# EAGLE design 2voices main (EAGLE 7.4.0)

## Sheet 1 of 2
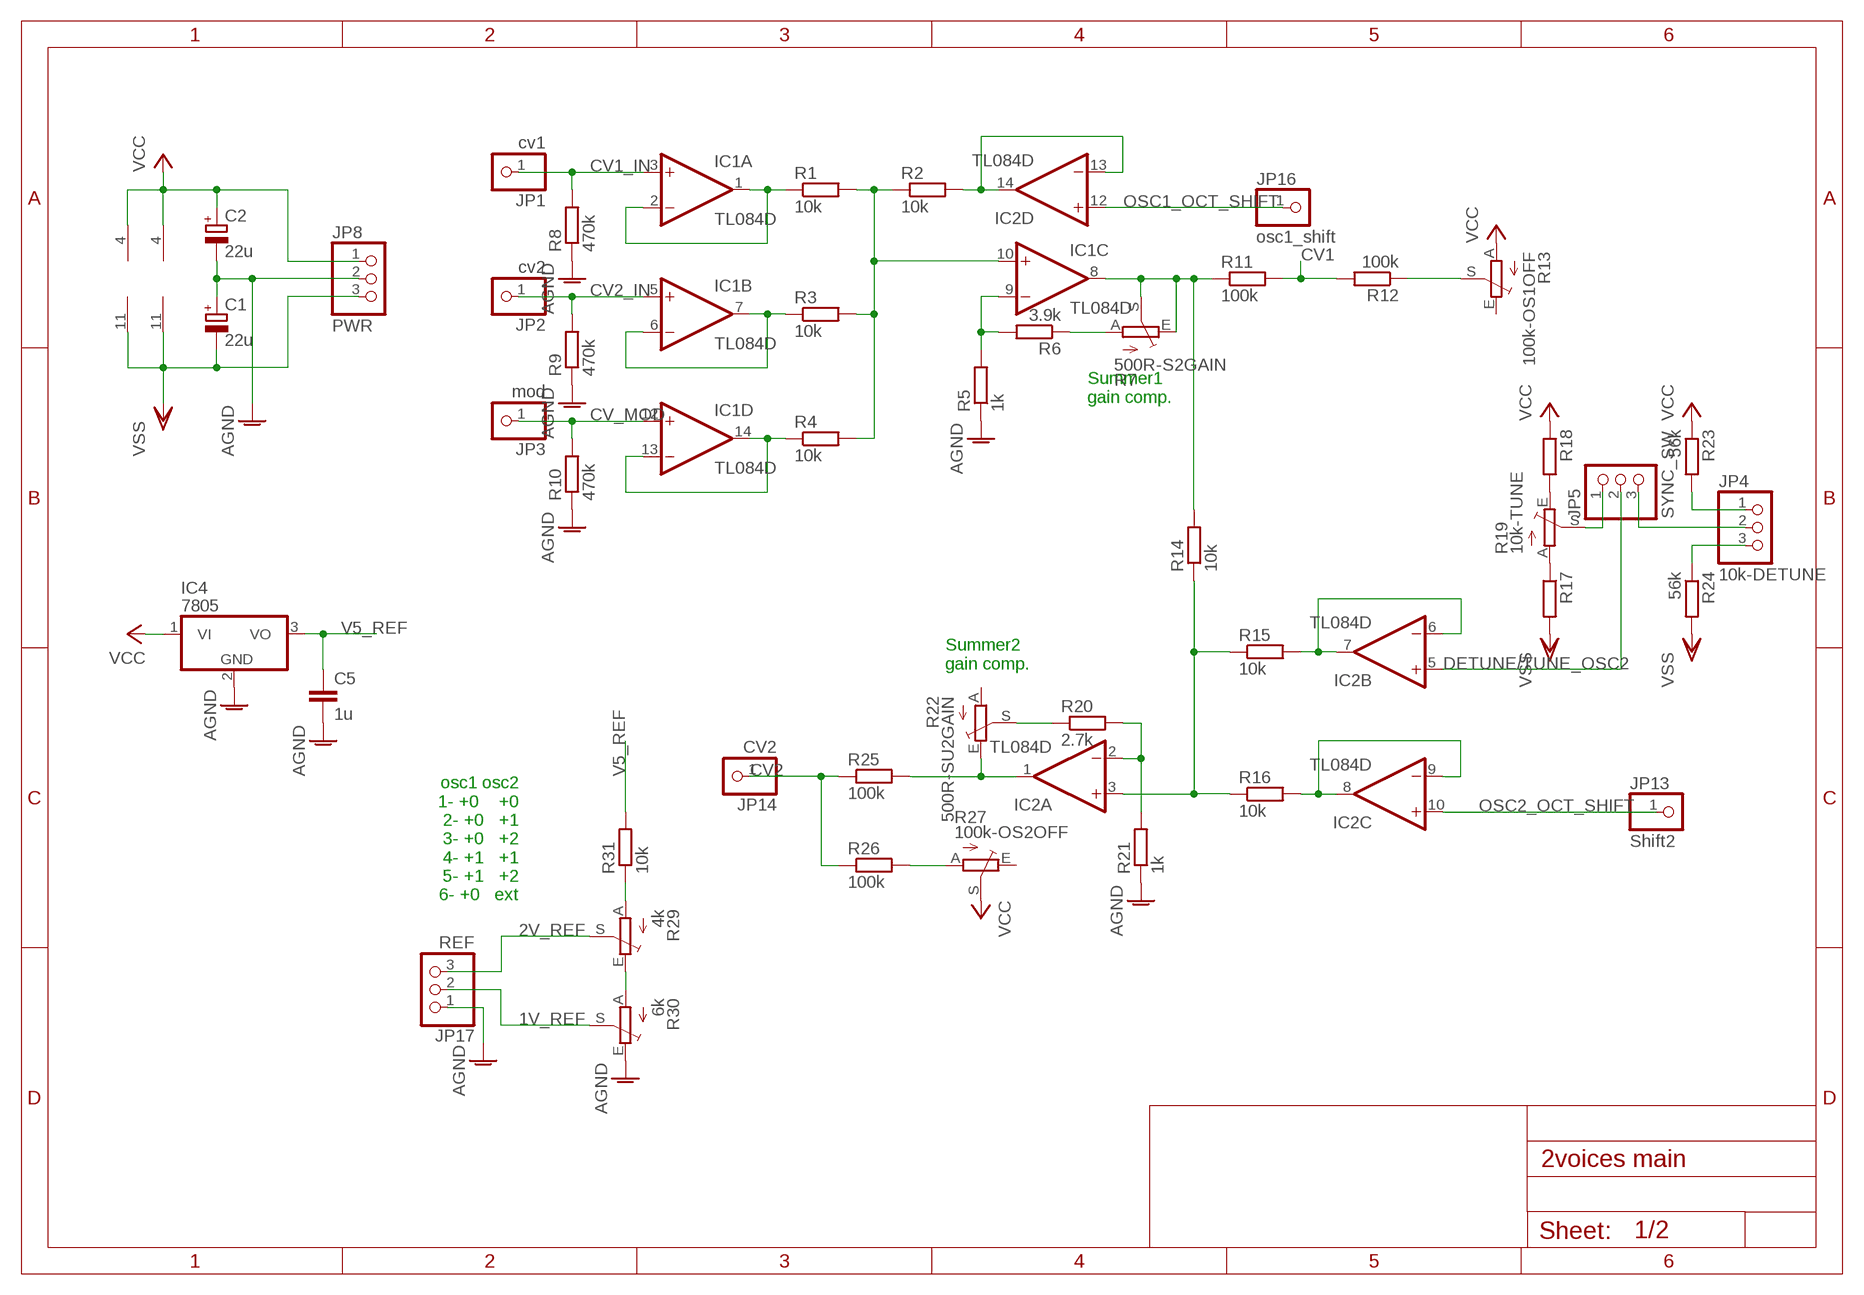
[diagram p0: schematic, sheet 1]

### Parts
C1  22u  CPOL-EUE2.5-7  [E2,5-7]
C2  22u  CPOL-EUE2.5-7  [E2,5-7]
C5  1u  C-EUC0805  [C0805]
IC1  TL084D  [SO14]
IC2  TL084D  [SO14]
IC4  7805  7805TV  [TO220V]
JP1  cv1  PINHD-1X1  [1X01]
JP2  cv2  PINHD-1X1  [1X01]
JP3  mod  PINHD-1X1  [1X01]
JP4  10k-DETUNE  PINHD-1X3  [1X03]
JP5  SYNC_SW  PINHD-1X3  [1X03]
JP8  PWR  PINHD-1X3  [1X03]
JP13  Shift2  PINHD-1X1  [1X01]
JP14  CV2  PINHD-1X1  [1X01]
JP16  osc1_shift  PINHD-1X1  [1X01]
JP17  REF  PINHD-1X3  [1X03]
R1  10k  R-EU_R0805  [R0805]
R2  10k  R-EU_R0805  [R0805]
R3  10k  R-EU_R0805  [R0805]
R4  10k  R-EU_R0805  [R0805]
R5  1k  R-EU_R0805  [R0805]
R6  3.9k  R-EU_R0805  [R0805]
R7  500R-S2GAIN  TRIM_EU-S63S  [S63S]
R8  470k  R-EU_R0805  [R0805]
R9  470k  R-EU_R0805  [R0805]
R10  470k  R-EU_R0805  [R0805]
R11  100k  R-EU_R0805  [R0805]
R12  100k  R-EU_R0805  [R0805]
R13  100k-OS1OFF  TRIM_EU-S63S  [S63S]
R14  10k  R-EU_R0805  [R0805]
R15  10k  R-EU_R0805  [R0805]
R16  10k  R-EU_R0805  [R0805]
R17  R-EU_R0805  [R0805]
R18  R-EU_R0805  [R0805]
R19  10k-TUNE  TRIM_EU-S63S  [S63S]
R20  2.7k  R-EU_R0805  [R0805]
R21  1k  R-EU_R0805  [R0805]
R22  500R-SU2GAIN  TRIM_EU-S63S  [S63S]
R23  56k  R-EU_R0805  [R0805]
R24  56k  R-EU_R0805  [R0805]
R25  100k  R-EU_R0805  [R0805]
R26  100k  R-EU_R0805  [R0805]
R27  100k-OS2OFF  TRIM_EU-S63S  [S63S]
R29  4k  TRIM_EU-S63S  [S63S]
R30  6k  TRIM_EU-S63S  [S63S]
R31  10k  R-EU_R0805  [R0805]

### Nets
1V_REF: JP17.2 R30.S
2V_REF: JP17.3 R29.S
AGND: C1.+ C2.- C5.2 IC4.2(GND) JP8.2 JP17.1 R5.1 R8.1 R9.1 R10.1 R21.1 R30.E ; also sheet 2
CV1: R11.2 R12.2
CV1_IN: IC1.3(A:+IN) JP1.1 R8.2
CV2: JP14.1 R25.1 R26.1
CV2_IN: IC1.5(B:+IN) JP2.1 R9.2
CV_MOD: IC1.12(D:+IN) JP3.1 R10.2
DETUNE/TUNE_OSC2: IC2.5(B:+IN) JP5.2
N$2: IC2.13(D:-IN) IC2.14(D:OUT) R2.2
N$3: R29.E R30.A
N$4: IC1.1(A:OUT) IC1.2(A:-IN) R1.1
N$5: R17.1 R19.A
N$6: IC1.6(B:-IN) IC1.7(B:OUT) R3.1
N$7: IC1.13(D:-IN) IC1.14(D:OUT) R4.1
N$8: IC1.10(C:+IN) R1.2 R2.1 R3.2 R4.2
N$9: IC1.9(C:-IN) R5.2 R6.2
N$10: R6.1 R7.A
N$11: R29.A R31.1
N$12: R12.1 R13.S
N$13: IC1.8(C:OUT) R7.E R7.S R11.1 R14.2
N$14: R18.2 R19.E
N$15: IC2.1(A:OUT) R22.E R25.2
N$16: R20.1 R22.S
N$17: IC2.2(A:-IN) R20.2 R21.2
N$18: IC2.3(A:+IN) R14.1 R15.1 R16.1
N$19: IC2.6(B:-IN) IC2.7(B:OUT) R15.2
N$20: JP4.1 R23.2
N$21: JP4.3 R24.1
N$22: JP4.2 JP5.3
N$23: JP5.1 R19.S
N$25: IC2.8(C:OUT) IC2.9(C:-IN) R16.2
N$28: R26.2 R27.A
OSC1_OCT_SHIFT: IC2.12(D:+IN) JP16.1
OSC2_OCT_SHIFT: IC2.10(C:+IN) JP13.1
V5_REF: C5.1 IC4.3(VO) R31.2
VCC: C2.+ IC1.4(P:V+) IC2.4(P:V+) IC4.1(VI) JP8.1 R13.A R18.1 R23.1 R27.S ; also sheet 2
VSS: C1.- IC1.11(P:V-) IC2.11(P:V-) JP8.3 R17.2 R24.2 ; also sheet 2
Unconnected: R13.E R22.A R27.E

### Notes on the sheet
- Summer1
  gain comp.
- Summer2
  gain comp.
- osc1 osc2
  1- +0    +0
  2- +0   +1
  3- +0   +2
  4- +1   +1
  5- +1   +2
  6- +0   ext

## Sheet 2 of 2
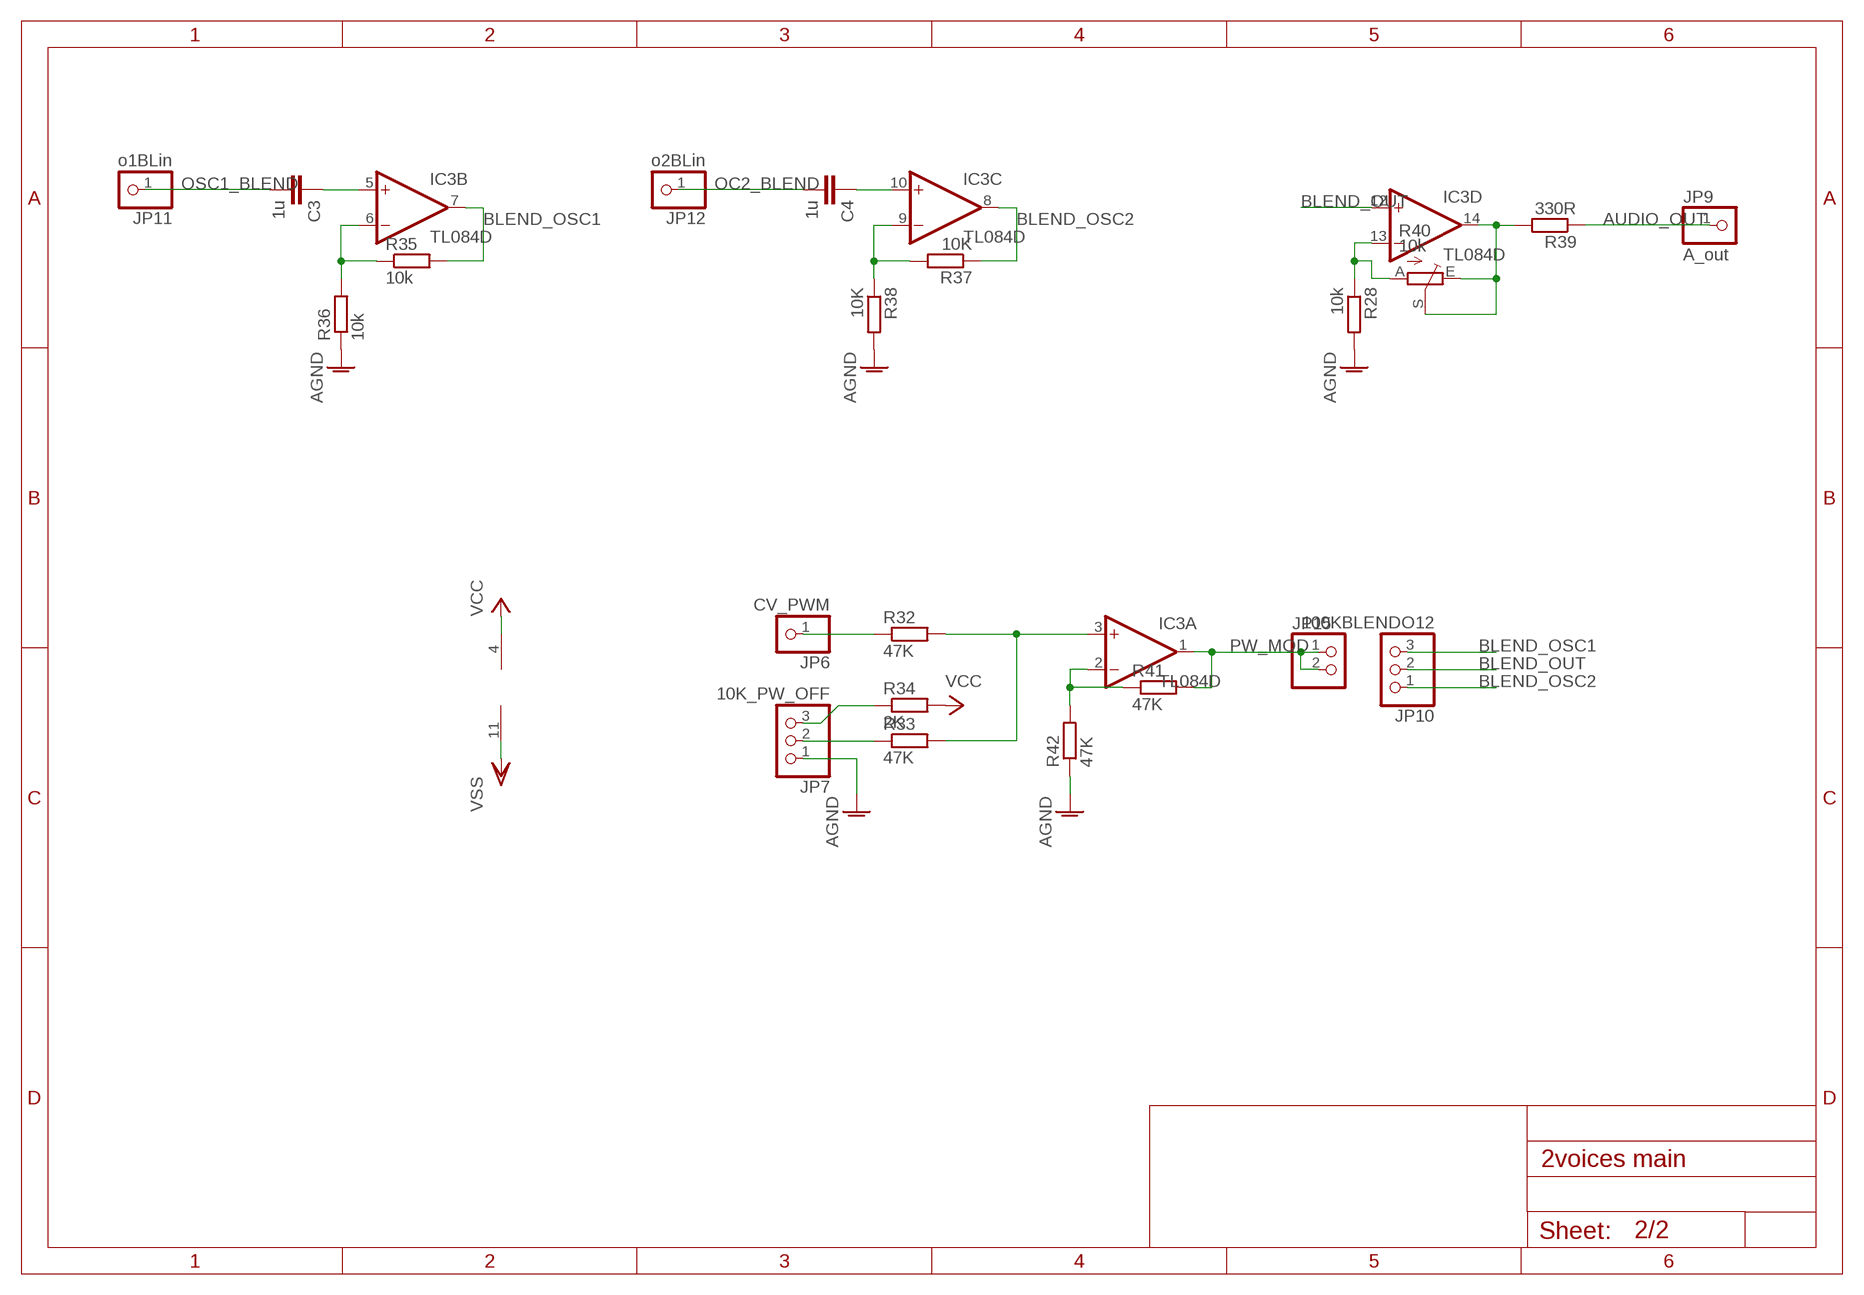
[diagram p1: schematic, sheet 2]

### Parts
C3  1u  C-EUC0805  [C0805]
C4  1u  C-EUC0805  [C0805]
IC3  TL084D  [SO14]
JP6  CV_PWM  PINHD-1X1  [1X01]
JP7  10K_PW_OFF  PINHD-1X3  [1X03]
JP9  A_out  PINHD-1X1  [1X01]
JP10  100KBLENDO12  PINHD-1X3  [1X03]
JP11  o1BLin  PINHD-1X1  [1X01]
JP12  o2BLin  PINHD-1X1  [1X01]
JP15  PINHD-1X2  [1X02]
R28  10k  R-EU_R0805  [R0805]
R32  47K  R-EU_R0805  [R0805]
R33  47K  R-EU_R0805  [R0805]
R34  2K  R-EU_R0805  [R0805]
R35  10k  R-EU_R0805  [R0805]
R36  10k  R-EU_R0805  [R0805]
R37  10K  R-EU_R0805  [R0805]
R38  10K  R-EU_R0805  [R0805]
R39  330R  R-EU_R0805  [R0805]
R40  10k  TRIM_EU-S63S  [S63S]
R41  47K  R-EU_R0805  [R0805]
R42  47K  R-EU_R0805  [R0805]

### Nets
AGND: JP7.1 R28.2 R36.1 R38.2 R42.1 ; also sheet 1
AUDIO_OUT: JP9.1 R39.1
BLEND_OSC1: IC3.7(B:OUT) JP10.3 R35.2
BLEND_OSC2: IC3.8(C:OUT) JP10.1 R37.1
BLEND_OUT: IC3.12(D:+IN) JP10.2
N$1: C3.1 IC3.5(B:+IN)
N$24: JP6.1 R32.1
N$26: JP7.2 R33.1
N$27: JP7.3 R34.1
N$29: IC3.13(D:-IN) R28.1 R40.A
N$30: IC3.3(A:+IN) R32.2 R33.2
N$31: IC3.6(B:-IN) R35.1 R36.2
N$33: IC3.9(C:-IN) R37.2 R38.1
N$34: IC3.14(D:OUT) R39.2 R40.E R40.S
N$35: C4.1 IC3.10(C:+IN)
N$62: IC3.2(A:-IN) R41.1 R42.2
OC2_BLEND: C4.2 JP12.1
OSC1_BLEND: C3.2 JP11.1
PW_MOD: IC3.1(A:OUT) JP15.1 JP15.2 R41.2
VCC: IC3.4(P:V+) R34.2 ; also sheet 1
VSS: IC3.11(P:V-) ; also sheet 1

## Library data of the parts
C1 C2 = rcl:CPOL-EU: POLARIZED CAPACITOR, European symbol
C3-C5 = rcl:C-EU: CAPACITOR, European symbol
IC1-IC3 = linear:TL084: OP AMP
IC4 = linear:78*: Positive VOLTAGE REGULATOR Source: http://cache.national.com/ds/LM/LM78L05.pdf http://www.fairchildsemi.com/ds/LM/LM7805.pdf
JP1-JP3 JP13 JP14 JP16 = pinhead:PINHD-1X1: PIN HEADER
JP4 JP5 JP7 JP8 JP10 JP17 = pinhead:PINHD-1X3: PIN HEADER
JP6 JP9 JP11 JP12 = adafruit:PINHD-1X1: Pin header 1x1 for 0.1" spacing With round pins
JP15 = pinhead:PINHD-1X2: PIN HEADER
R1-R6 R8-R12 R14-R18 R20 R21 R23-R26 R28 R31-R39 R41 R42 = rcl:R-EU_: RESISTOR, European symbol
R7 R13 R19 R22 R27 R29 R30 R40 = pot:TRIM_EU-: POTENTIOMETER

## Board
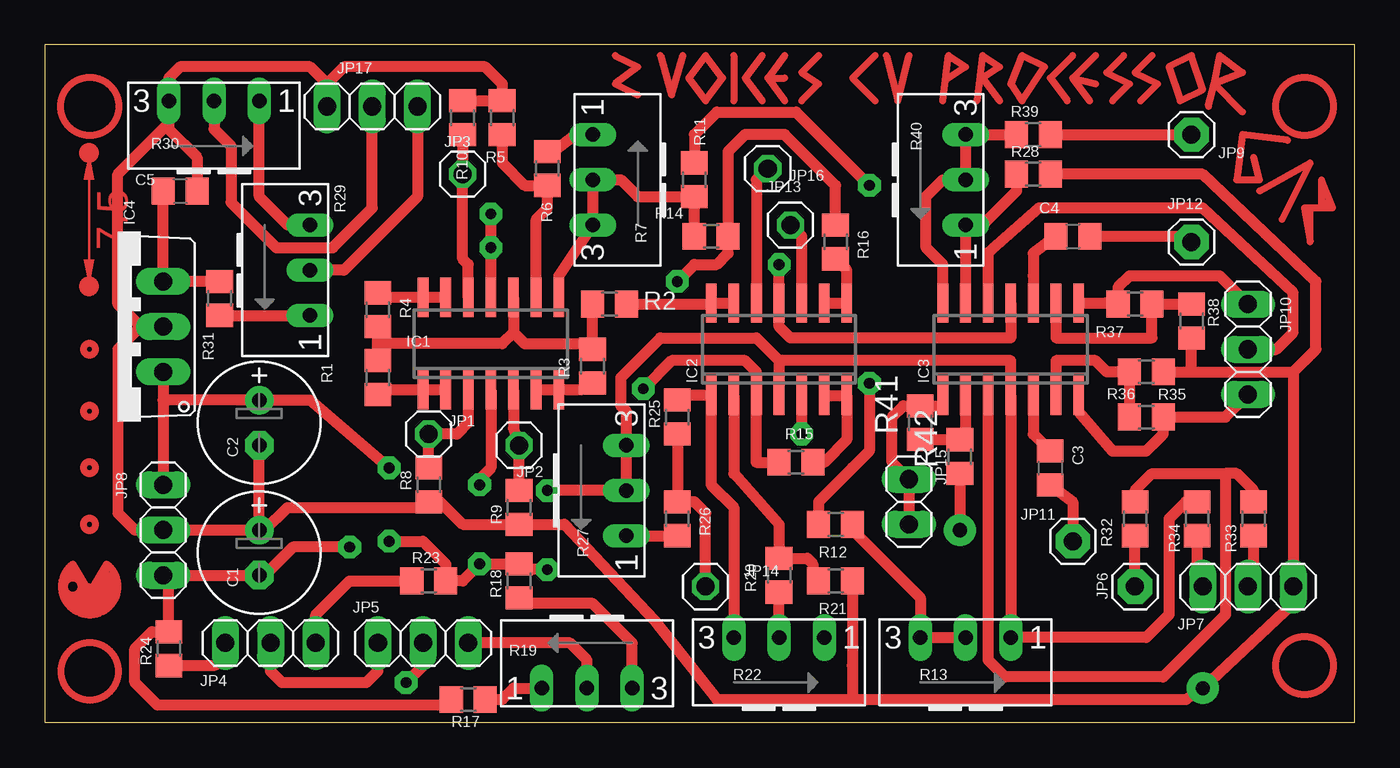
[diagram p2: board, top side]
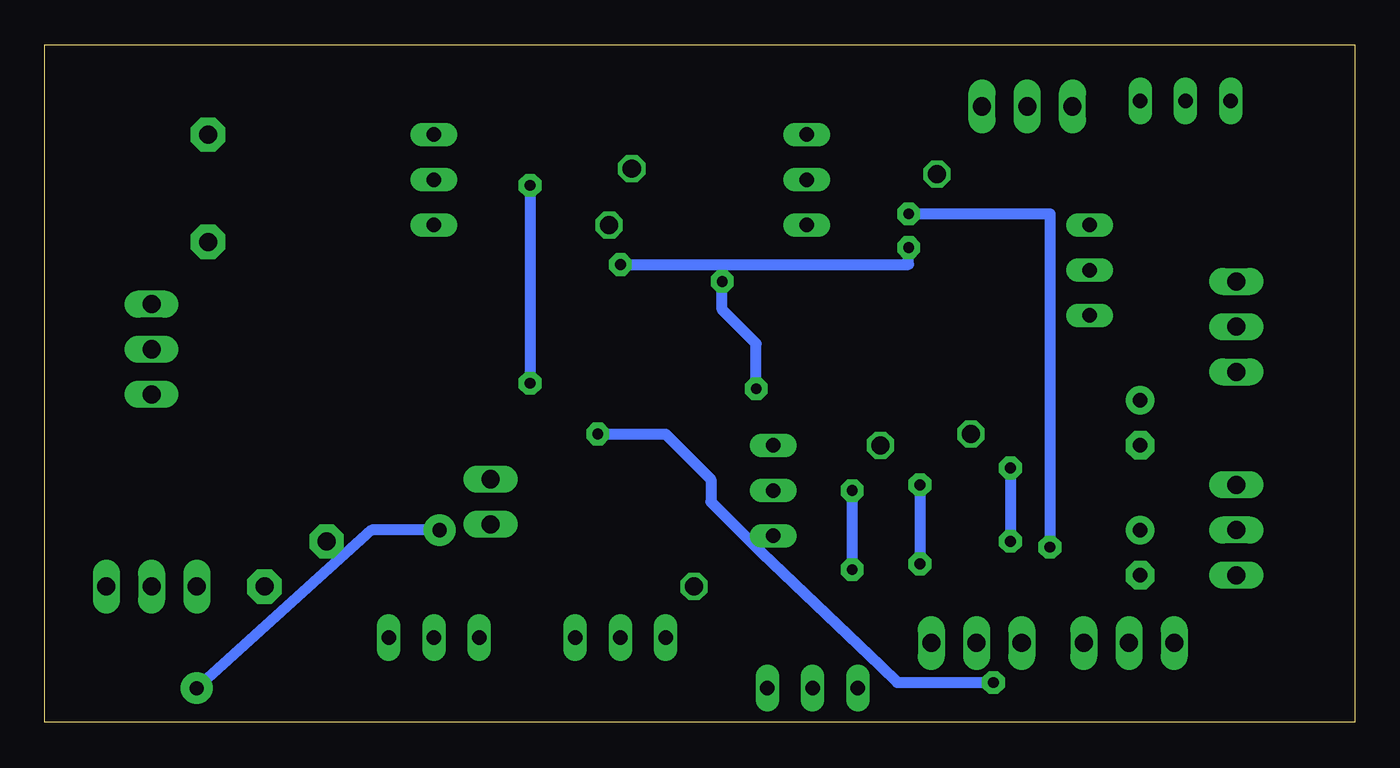
[diagram p3: board, bottom side, seen from below]

Size 73.64 x 38.09 mm. Coordinates in mm from the lower left corner, seen from the top.
Outline: 0,0 73.64,0 73.64,38.09 0,38.09 0,0
Copper layers (1*16): Top 0.035mm / dielectric 1.5mm / Bottom 0.035mm
Design rules "default": minimum track width 10mil, minimum drill 24mil, track to track 8mil, track to pad 8mil, pad to pad 8mil, via to via 8mil, smd to smd 8mil, copper to edge 40mil, drill to drill 8mil, minimum pad ring 10mil, minimum via ring 8mil, stop-mask expansion 4mil, vias tented up to drill 0mil, thermal gap 10mil

### Footprints (pad centres in the part's own frame; a part is rotated, then mirrored left to right if it is on the bottom)
E2,5-7 = drill 0.813 pad 1.6: + -1.27,0 | drill 0.813 pad 1.6 octagon: - 1.27,0
C0805 = smd 1.3 x 1.5: 1 -0.95,0; 2 0.95,0
SO14 = smd 0.6 x 2.2: 1 -3.81,-2.6; 2 -2.54,-2.6; 3 -1.27,-2.6; 4 0,-2.6; 5 1.27,-2.6; 6 2.54,-2.6; 7 3.81,-2.6; 8 3.81,2.6; 9 2.54,2.6; 10 1.27,2.6; 11 0,2.6; 12 -1.27,2.6; 13 -2.54,2.6; 14 -3.81,2.6
TO220V = drill 1.016 long: 1 -2.54,-2.54; 2 0,-2.54; 3 2.54,-2.54
1X01 = drill 1.016 octagon: 1 0,0
1X03 = drill 1.016 long: 1 -2.54,0; 2 0,0; 3 2.54,0
1X01' = drill 1.016 pad 1.93 octagon: 1 0,0
1X02 = drill 1.016 long: 1 -1.27,0; 2 1.27,0
R0805 = smd 1.3 x 1.5: 1 -0.95,0; 2 0.95,0
S63S = drill 0.813 long: A 2.54,1.27; E -2.54,1.27; S 0,1.27

### Placement (x,y rotation side)
C1  12.06,9.53 270 top
C2  12.06,16.83 270 top
C3  56.52,14.29 270 top
C4  57.78,27.3 0 top
C5  7.62,29.84 0 top
IC1  25.08,21.27 0 top
IC2  41.27,20.95 0 top
IC3  54.29,20.95 0 top
IC4  4.13,22.23 90 top
JP1  21.59,16.19 180 top
JP2  26.67,15.56 180 top
JP3  23.5,30.8 0 top
JP4  12.7,4.45 180 top
JP5  21.27,4.45 180 top
JP6  CV_PWM  [1X01']  61.28,7.62 90 top
JP7  67.63,7.62 180 top
JP8  6.67,10.79 270 top
JP9  A_out  [1X01']  64.45,33.02 180 top
JP10  67.63,20.95 270 top
JP11  o1BLin  [1X01']  57.78,10.16 0 top
JP12  o2BLin  [1X01']  64.45,26.99 0 top
JP13  41.91,27.94 0 top
JP14  37.15,7.62 0 top
JP15  48.58,12.38 270 top
JP16  40.64,31.11 0 top
JP17  18.41,34.61 0 top
R1  18.73,19.37 90 top
R2  31.75,23.5 0 top
R3  30.8,20 90 top
R4  18.73,23.18 270 top
R5  25.72,33.97 270 top
R6  28.26,31.11 270 top
R7  32.07,30.48 90 top
R8  21.59,13.34 90 top
R9  26.67,12.06 90 top
R10  23.5,33.97 270 top
R11  36.51,30.48 90 top
R12  44.45,11.11 180 top
R13  51.75,3.49 0 top
R14  37.47,27.3 180 top
R15  42.23,14.61 0 top
R16  44.45,26.99 270 top
R17  23.81,1.27 180 top
R18  26.67,7.94 270 top
R19  30.48,3.17 180 top
R20  41.27,8.26 90 top
R21  44.45,7.94 180 top
R22  41.27,3.49 0 top
R23  21.59,7.94 180 top
R24  6.99,4.13 90 top
R25  35.56,17.14 90 top
R26  35.56,11.43 270 top
R27  31.43,13.02 270 top
R28  55.56,30.8 0 top
R29  13.65,25.4 270 top
R30  9.53,33.66 0 top
R31  9.84,23.81 90 top
R32  61.28,11.43 90 top
R33  67.94,11.43 90 top
R34  64.77,11.43 90 top
R35  61.91,17.14 0 top
R36  61.91,19.68 180 top
R37  61.28,23.5 0 top
R38  64.45,22.54 270 top
R39  55.56,33.02 180 top
R40  50.48,30.48 270 top
R41  49.21,16.83 90 top
R42  51.44,14.92 90 top

### Tracks (layer width: path | path; a pad name or v marks a point on that pad's centre or on a via)
1V_REF
  Top 0.61: R30.S 9.53,33.34 10.48,32.38 10.48,29.21 13.02,26.67 16.19,26.67 18.41,28.89 JP17.2
2V_REF
  Top 0.61: JP17.3 20.95,29.53 16.83,25.4 R29.S
AGND  (via drill 0.8 pad 1.78)
  Top 0.61: C1.+ JP8.2 5.08,10.79 4.13,11.75 4.13,20.95 5.4,22.23 | C1.+ C2.- | R36.1 64.45,19.68 | 64.45,19.68 R38.2 | 64.45,19.68 70.17,19.68 | 70.17,19.68 71.44,20.95 71.44,24.77 65.09,30.8 R28.2 | 70.17,19.68 JP7.1 70.17,6.67 v65.09,1.91 64.14,1.27 45.4,1.27 | R5.1 | JP17.1 15.88,35.88 | 15.88,35.88 14.92,36.83 7.62,36.83 6.99,36.2 R30.E 6.99,33.66 | R5.1 | R5.1 25.72,34.61 R5.1 | 15.88,35.88 16.83,36.83 24.77,36.83 25.72,35.88 R5.1 | 45.4,1.27 37.78,1.27 34.29,5.71 29.21,11.11 27.3,11.12 R9.1 26.35,11.11 23.5,11.11 22.22,12.38 R8.1 21.27,12.06 13.65,12.06 12.38,10.79 C1.+ | R42.1 v51.44,10.79 | 6.99,33.66 6.99,33.34 8.57,31.75 C5.2 | 5.4,22.23 4.13,23.5 4.13,30.8 6.99,33.66 | IC4.2 5.4,22.23 | R10.1 R5.1 | R21.1 45.4,3.18 45.4,1.27
  Bottom 0.61: v51.44,10.79 55.24,10.79 v65.09,1.91
AUDIO_OUT
  Top 0.61: R39.1 JP9.1
BLEND_OSC1
  Top 0.61: IC3.7 58.1,17.46 60.01,15.24 61.91,15.24 62.87,16.19 R35.2 66.36,17.14 JP10.3
BLEND_OSC2
  Top 0.61: IC3.8 59.63,23.55 R37.1 60.33,23.18 60.33,24.45 60.96,25.08 66.04,25.08 JP10.1
BLEND_OUT
  Top 0.61: JP10.2 69.22,20.95 70.17,21.91 70.17,24.13 65.09,28.89 55.88,28.89 53.02,26.35 IC3.12
CV1  (via drill 0.6 pad 1.27)
  Top 0.61: v46.35,30.16 42.23,34.29 37.78,34.29 36.51,33.02 R11.2 | v46.35,19.05 46.35,15.24 | 46.35,15.24 45.4,14.29 | 45.4,14.29 46.35,15.24 | 45.4,14.29 43.5,12.38 R12.2
  Bottom 0.61: v46.35,30.16 v46.35,19.05
CV1_IN
  Top 0.61: IC1.3 23.81,16.83 23.18,16.19 JP1.1 R8.2
CV2
  Top 0.61: R25.1 R26.1 36.51,12.38 37.15,11.75 JP14.1
CV2_IN
  Top 0.61: IC1.5 26.35,16.51 JP2.1 R9.2
CV_MOD
  Top 0.61: R10.2 JP3.1 23.5,26.04 23.81,25.72 IC1.12
DETUNE/TUNE_OSC2  (via drill 0.6 pad 1.27)
  Top 0.61: IC2.5 v42.55,16.19 | v20.32,2.22 21.27,3.17 JP5.2
  Bottom 0.61: v42.55,16.19 38.73,16.19 36.2,13.65 36.2,12.38 33.34,9.53 26.67,3.17 25.72,2.22 v20.32,2.22
N$1
  Top 0.61: IC3.5 55.56,16.2 C3.1
N$2
  Top 0.61: R2.2 37.41,23.5 IC2.14 IC2.13
N$3
  Top 0.61: R29.E 13.65,27.94 12.06,29.53 R30.A
N$4
  Top 0.61: IC1.2 IC1.1 18.99,18.67 R1.1
N$5
  Top 0.61: R17.1 25.72,1.27 26.35,1.91 R19.A
N$6
  Top 0.61: IC1.6 IC1.7 30.16,18.67 R3.1
N$7
  Top 0.61: IC1.13 IC1.14 18.99,23.87 R4.1
N$8
  Top 0.61: R1.2 18.73,21.27 | 18.73,21.27 R4.2 | IC1.10 26.35,21.91 | 26.35,21.91 25.72,21.27 18.73,21.27 | 26.35,21.91 26.99,21.27 30.48,21.27 R3.2 R2.1
N$9
  Top 0.61: R5.2 25.72,31.43 26.99,30.16 R6.2 28.26,28.89 27.62,28.26 IC1.9
N$10
  Top 0.61: R6.1 28.57,32.06 29.84,33.02 R7.A
N$11
  Top 0.61: R31.1 10.47,22.86 11.11,22.86 R29.A
N$12
  Top 0.61: R12.1 45.4,10.79 49.21,6.99 49.21,4.76 R13.S
N$13
  Top 0.61: IC1.8 28.89,25.08 R7.E R7.S 32.38,30.48 33.34,29.53 R11.1 R14.2
N$14
  Top 0.61: R19.E 33.02,4.45 30.8,6.67 26.99,6.67 R18.2
N$15
  Top 0.61: R25.2 35.3,18.36 IC2.1 37.47,13.34 38.73,12.06 R22.E
N$16
  Top 0.61: R22.S R20.1
N$17
  Top 0.61: IC2.2 38.73,13.97 41.28,11.11 R20.2 42.87,9.21 43.18,8.89 43.18,8.26 R21.2
N$18  (via drill 0.6 pad 1.27)
  Top 0.61: R16.1 44.45,30.16 41.59,33.02 39.37,33.02 38.42,32.07 38.42,27.62 R14.1 38.42,26.35 37.78,25.72 36.51,25.72 v35.56,24.77 | v33.66,18.73 35.24,20.32 39.37,20.32 40.01,19.68 IC2.3 40.01,14.61 R15.1
  Bottom 0.61: v33.66,18.73 33.66,21.27 35.56,23.18 v35.56,24.77
N$19
  Top 0.61: IC2.6 IC2.7 45.09,15.88 43.81,14.61 R15.2
N$20
  Top 0.61: JP4.1 15.24,6.03 17.14,7.94 R23.2
N$21
  Top 0.61: JP4.3 10.16,3.49 9.53,3.17 R24.1
N$22
  Top 0.61: JP4.2 12.7,2.86 13.34,2.22 18.1,2.22 18.73,2.86 JP5.3
N$23
  Top 0.61: R19.S 30.48,3.49 29.53,4.45 JP5.1
N$24
  Top 0.61: JP6.1 R32.1
N$25
  Top 0.61: IC2.9 IC2.8 45.09,25.4 R16.2
N$26
  Top 0.61: JP7.2 67.94,8.57 R33.1
N$27
  Top 0.61: JP7.3 64.77,7.62 R34.1
N$28
  Top 0.61: R27.A 34.92,10.48 35.24,10.16 R26.2
N$29
  Top 0.61: IC3.13 R40.A 52.7,27.94 54.61,29.85 R28.1
N$30
  Top 0.61: R33.2 67.94,13.02 66.99,13.97 66.36,13.97 | R32.2 61.28,13.02 62.23,13.97 66.36,13.97 | 66.36,13.97 66.36,6.03 62.87,2.54 53.98,2.54 53.02,3.49 IC3.3
N$31
  Top 0.61: IC3.6 56.83,20.32 59.05,20.32 59.69,19.68 R36.2 R35.1
N$33
  Top 0.61: IC3.9 56.83,21.59 62.23,21.59 R37.2 R38.1
N$34
  Top 0.61: R39.2 R40.E R40.S 50.48,30.48 49.53,29.53 49.53,26.67 50.48,25.72 IC3.14
N$35
  Top 0.61: C4.1 55.56,26.36 55.56,25.08 IC3.10
N$36
  Top 0.406: 32.07,37.47 33.34,36.83 32.07,35.88 33.34,35.24
N$37
  Top 0.406: 34.61,37.47 35.24,35.24 35.88,37.47
N$38
  Top 0.406: 37.15,37.47 36.2,36.2 37.15,34.92 38.1,36.2 37.15,37.47
N$40
  Top 0.406: 38.73,37.47 38.73,34.92
N$41
  Top 0.406: 40.32,37.47 39.37,36.2 40.32,34.92
N$42
  Top 0.406: 41.59,37.47 40.64,36.2 | 40.64,36.2 41.59,34.92 | 40.64,36.2 41.59,36.2
N$43
  Top 0.406: 43.5,37.47 42.55,36.51 43.5,35.88 42.55,34.92
N$44
  Top 0.406: 46.67,37.47 45.4,36.2 46.67,34.92
N$45
  Top 0.406: 47.31,37.47 47.94,34.92 48.58,37.47
N$46
  Top 0.406: 50.48,34.92 50.8,37.47 51.75,36.83 50.8,36.2
N$47
  Top 0.406: 52.39,34.92 52.7,37.47 53.66,36.83 52.7,36.2 53.66,34.92
N$48
  Top 0.406: 54.93,37.47 54.29,35.88 54.93,34.92 56.2,36.83 54.93,37.47
N$49
  Top 0.406: 57.78,37.47 56.52,36.2 57.47,34.92
N$50
  Top 0.406: 59.05,37.47 57.78,36.2 | 58.74,34.92 57.78,36.2 | 57.78,36.2 59.05,35.88
N$51
  Top 0.406: 60.64,37.47 59.69,36.51 60.96,35.88 60.01,34.92
N$52
  Top 0.406: 62.23,37.47 61.28,36.51 62.55,35.88 61.59,34.92
N$53
  Top 0.406: 64.45,37.47 63.18,36.83 63.82,34.92 65.09,35.56 64.45,37.47
N$54
  Top 0.406: 65.41,34.61 65.72,35.88 | 65.72,35.88 66.04,37.47 67.31,36.51 65.72,35.88 | 65.72,35.88 67.31,34.29
N$55
  Top 0.406: 69.85,32.7 67.31,33.02 66.99,30.48 68.26,30.48 67.94,31.75
N$56
  Top 0.406: 68.26,29.84 71.12,31.43 69.53,28.26
N$57
  Top 0.406: 71.75,28.89 72.39,28.89 71.75,30.48 71.75,28.89 | 71.75,28.89 71.12,28.89 | 71.12,28.89 70.8,28.89 71.12,26.99 71.12,28.89 | 71.75,28.89 72.07,29.21
N$59
  Top 0.406: 1.59,6.67 1.59,6.99 arc180 1.27,6.99 arc217 2.22,7.3 arc-254 2.54,7.3
N$60
  Top 0.406: 2.22,6.99 1.91,6.99 1.91,6.67 arc90 2.22,6.99 | 2.22,6.99 2.86,6.99 | 2.86,6.99 2.86,7.62 | 2.86,7.62 3.17,7.62 | 3.17,7.62 3.17,7.94 | 3.17,7.94 arc90 3.49,8.26 | 3.49,8.57 arc90 3.17,8.26 3.17,7.94 | 3.17,7.94 arc90 3.49,8.26 | 3.49,8.26 3.81,8.26 3.81,7.94 arc-90 3.49,7.62 3.17,7.62 | 3.17,7.62 arc90 3.49,7.94 arc90 3.81,7.62 4.13,7.62 arc-90 3.81,7.3 3.17,7.3 3.17,6.99 3.81,6.99 arc90 3.49,6.67 3.17,6.67 | 3.17,6.67 2.54,6.67 arc90 2.22,6.35 2.86,6.35 arc90 3.17,6.67 | 3.17,6.67 arc90 2.86,6.99 | 2.22,6.99 2.22,7.62 | 2.54,7.3 1.59,8.89 arc286 3.49,8.89 2.54,7.3 | 3.17,7.94 arc-90 2.86,7.62 | 2.86,7.62 2.54,7.3
N$61
  Top 0.406: 1.27,8.26 arc90 1.59,8.57 1.59,8.26 1.91,8.26
N$62
  Top 0.61: IC3.2 51.75,16.19 R42.2 R41.1
OC2_BLEND
  Top 0.61: C4.2 63.82,27.3 64.14,26.99 JP12.1
OSC1_BLEND
  Top 0.61: C3.2 57.78,12.38 JP11.1
OSC1_OCT_SHIFT
  Top 0.61: JP16.1 40.01,30.48 IC2.12
OSC2_OCT_SHIFT
  Top 0.61: JP13.1 42.55,27.3 IC2.10
PW_MOD
  Top 0.61: JP15.2 JP15.1 47.62,14.61 47.62,17.14 48.26,17.78 R41.2 50.48,17.78 IC3.1
V5_REF
  Top 0.61: C5.1 IC4.3 R31.2
VCC  (via drill 0.6 pad 1.27)
  Top 0.61: IC4.1 6.67,18.1 | 6.67,18.1 JP8.1 | 41.27,20.32 40.01,21.59 34.61,21.59 32.38,19.37 32.38,17.78 32.7,17.46 R27.S v28.26,13.02 | 41.27,20.32 IC2.4 | 6.67,18.1 C2.+ 14.92,18.1 v19.37,14.29 | R34.2 64.13,12.38 63.18,11.43 63.18,6.03 61.91,4.76 R13.A IC3.4 54.29,20.32 41.27,20.32 | IC1.4 25.08,14.29 24.45,13.65 v24.45,13.34 | v19.37,10.16 21.27,10.16 22.54,8.89 22.54,8.57 R23.1 23.5,7.94 v24.45,8.89 R18.1 26.98,8.57 v28.26,8.57
  Bottom 0.61: v24.45,13.34 v24.45,8.89 | v19.37,14.29 v19.37,10.16 | v28.26,13.02 v28.26,8.57
VSS  (via drill 0.6 pad 1.27)
  Top 0.61: R17.2 22.23,0.95 6.35,0.95 5.08,2.22 5.08,4.13 6.03,5.08 R24.2 6.99,7.94 JP8.3 C1.- 12.38,8.26 13.97,9.84 v17.14,9.84 | IC3.11 54.29,21.59 41.91,21.59 41.27,22.23 IC2.11 v41.27,25.72 | IC1.11 v25.08,26.67 v25.08,28.57
  Bottom 0.61: v41.27,25.72 25.08,25.72 v25.08,26.67 | v25.08,28.57 17.14,28.57 v17.14,9.84
(copper drawn outside any net)
  shapes: Top area x1, Top circle x11